# EAGLE design 3w-rgb-led-connector-mk-5.0 (EAGLE 6.5.0)
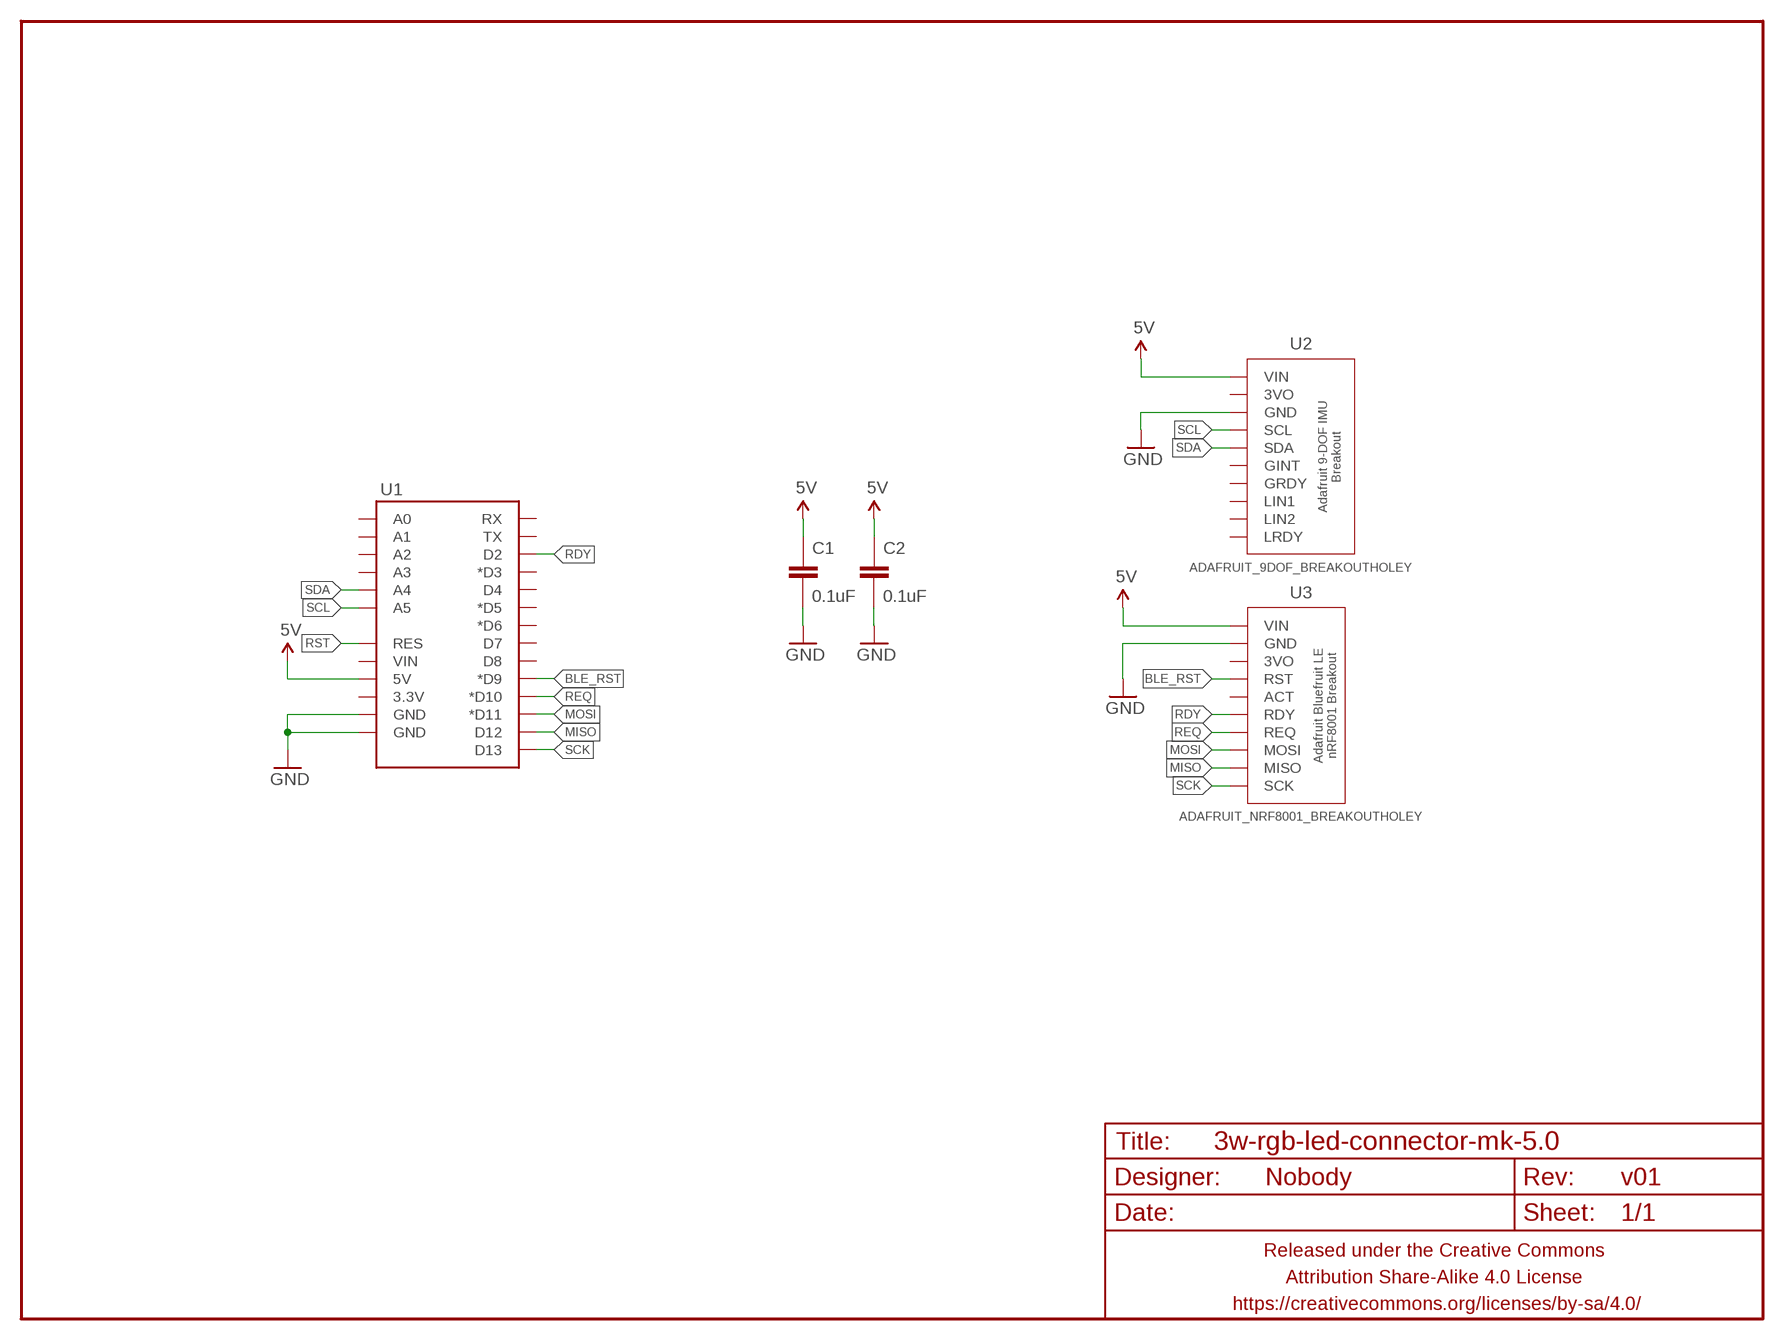
[diagram p0: schematic, sheet 1]

## Parts
C1  0.1uF  CAPACITOR-CERAMIC025-024X044  [C025-024X044]
C2  0.1uF  CAPACITOR-CERAMIC025-024X044  [C025-024X044]
FRAME1  FRAME-LETTERNO_PACKAGE  [DUMMY]
U1  ARDUINO_SHIELD_SMALLER  [ARDUINO_SHIELD_NOOUTLINE_INSIDE_SMALLER]
U2  ADAFRUIT_9DOF_BREAKOUTHOLEY  [ADAFRUIT_9DOF_BREAKOUT_HOLEY]
U3  ADAFRUIT_NRF8001_BREAKOUTHOLEY  [ADAFRUIT_NRF8001_HOLEY]

## Nets
5V: C1.1 C2.1 U1.5V U2.VIN U3.VIN
BLE_RST: U1.D9(*D9) U3.RST
GND: C1.2 C2.2 U1.GND@0(GND) U1.GND@1(GND) U2.GND U3.GND
MISO: U1.D12 U3.MISO
MOSI: U1.D11(*D11) U3.MOSI
RDY: U1.D2 U3.RDY
REQ: U1.D10(*D10) U3.REQ
RST: U1.RES
SCK: U1.D13 U3.SCK
SCL: U1.A5 U2.SCL
SDA: U1.A4 U2.SDA
Unconnected: U1.3.3V U1.A0 U1.A1 U1.A2 U1.A3 U1.D3(*D3) U1.D4 U1.D5(*D5) U1.D6(*D6) U1.D7 U1.D8 U1.RX U1.TX U1.VIN U2.3VO U2.GINT U2.GRDY U2.LIN1 U2.LIN2 U2.LRDY U3.3VO U3.ACT

## Library data of the parts
C1 C2 = A_butts:CAPACITOR-CERAMIC: CAPACITOR, European symbol
FRAME1 = A_butts:FRAME-LETTER: Schematic Frame Standard 8.5x11 US Letter frame; DESIGNER: Nobody; VERSION: v01
U1 = A_butts:ARDUINO_SHIELD_SMALLER
U2 = A_butts:ADAFRUIT_9DOF_BREAKOUT
U3 = A_butts:ADAFRUIT_NRF8001_BREAKOUT

## Board
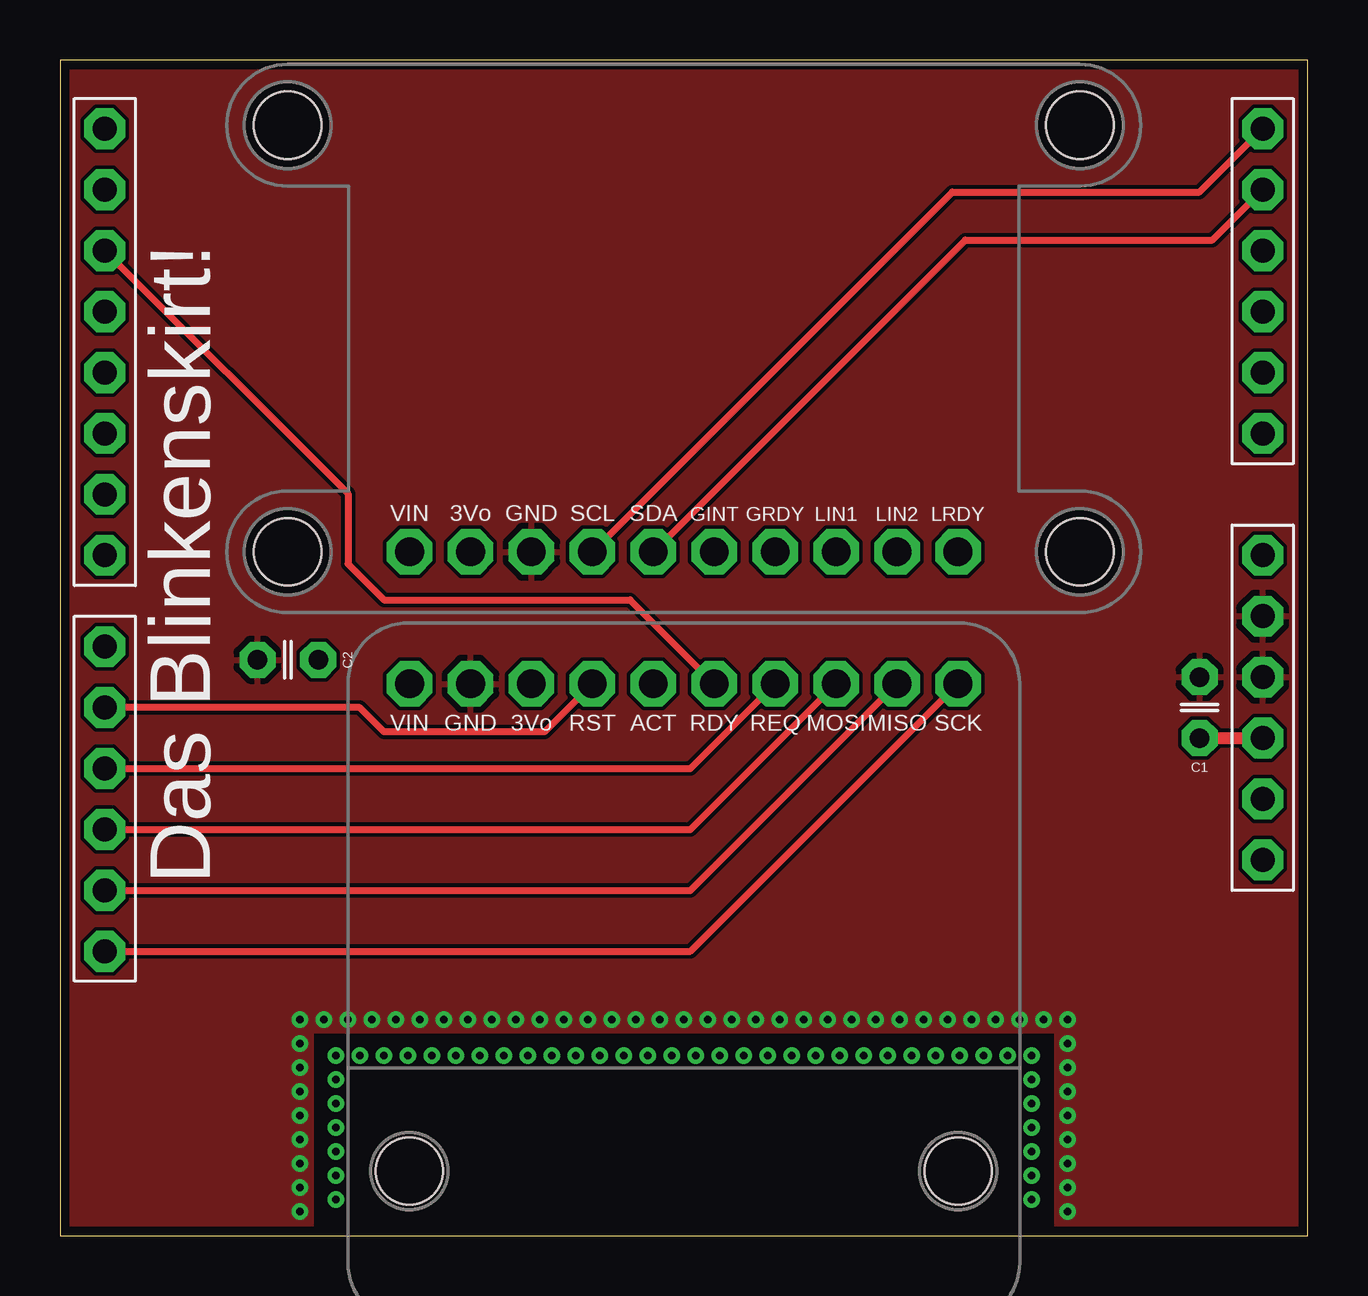
[diagram p1: board, top side]
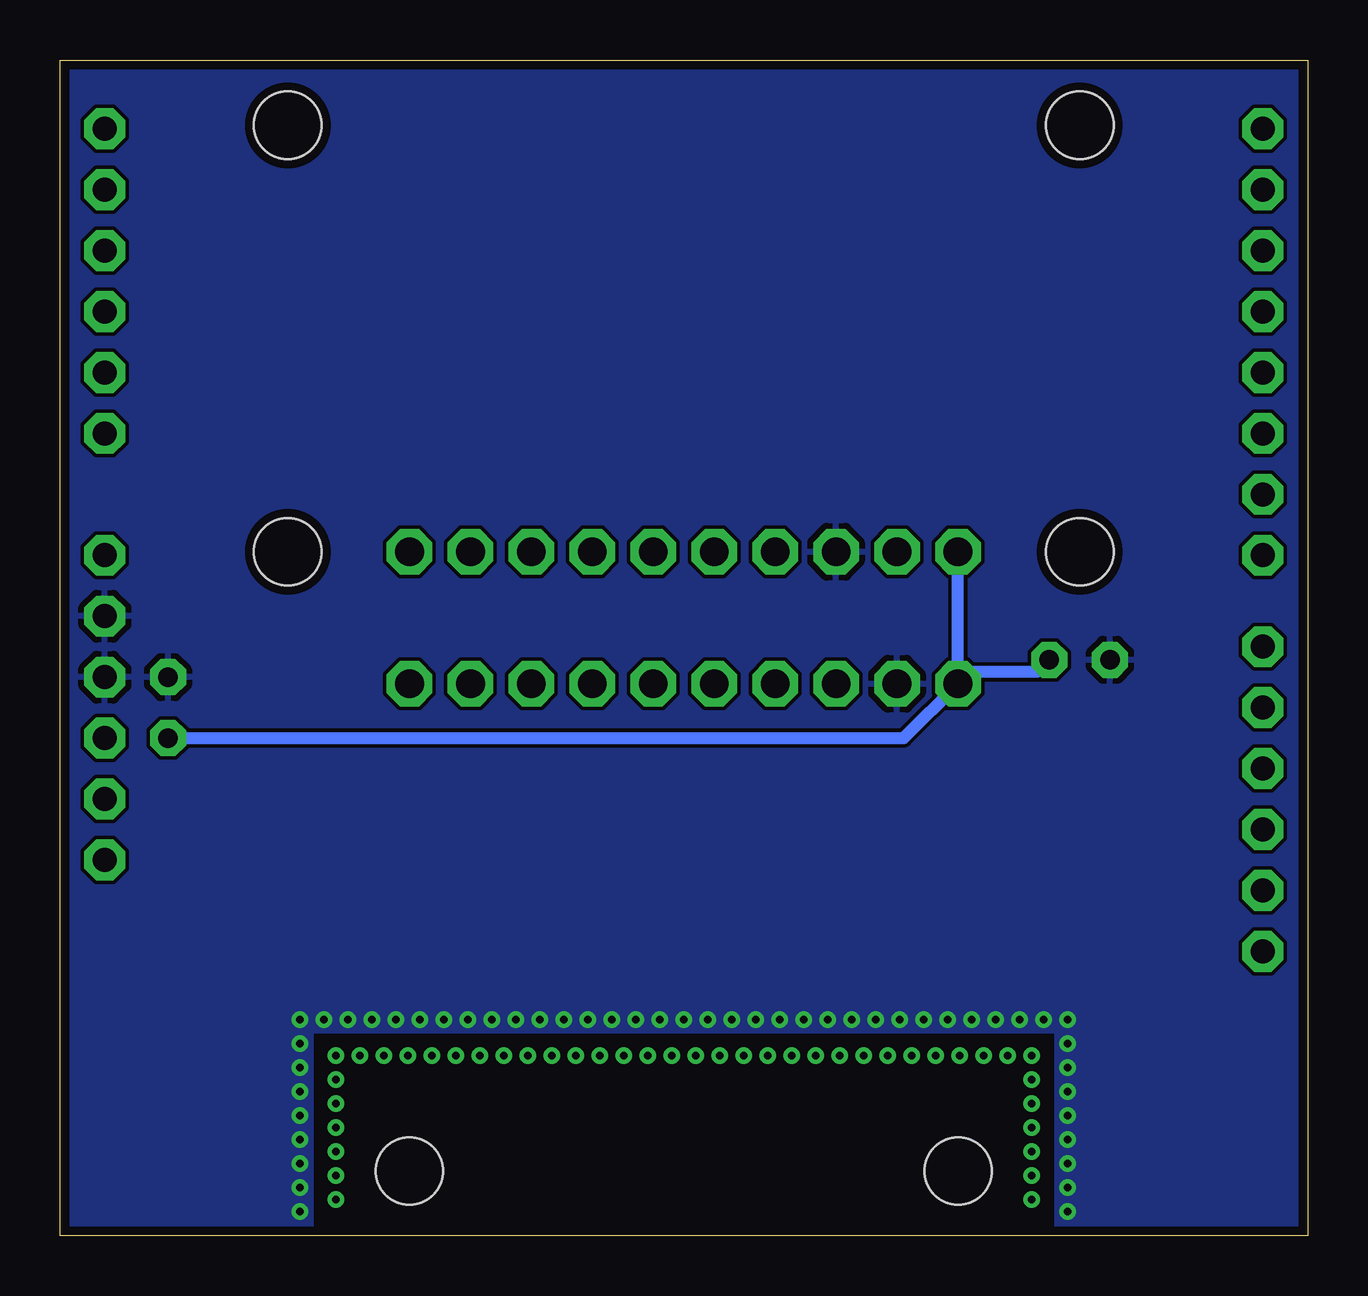
[diagram p2: board, bottom side, seen from below]

Size 52 x 49 mm. Coordinates in mm from the lower left corner, seen from the top.
Outline: 0,49 0,0 52,0 52,49 0,49
Copper layers (1*16): Top 0.0356mm / dielectric 1.5011mm / Bottom 0.0356mm
Design rules "LaenPCBOrder_2": minimum track width 6mil, minimum drill 13mil, track to track 6mil, track to pad 6mil, pad to pad 6mil, via to via 6mil, smd to smd 6mil, copper to edge 15mil, drill to drill 6mil, minimum pad ring 7mil, minimum via ring 7mil, stop-mask expansion 3mil, vias tented up to drill 20mil, thermal gap 10mil

### Footprints (pad centres in the part's own frame; a part is rotated, then mirrored left to right if it is on the bottom)
C025-024X044 = drill 0.813 pad 1.5 octagon: 1 -1.27,0; 2 1.27,0
ARDUINO_SHIELD_NOOUTLINE_INSIDE_SMALLER = drill 1 pad 1.7 octagon: 3.3V 48.26,-27.94; 5V 48.26,-25.4; A0 48.26,-12.7; A1 48.26,-10.16; A2 48.26,-7.62; A3 48.26,-5.08; A4 48.26,-2.54; A5 48.26,0; D2 0,-5.08; D3 0,-7.62; D4 0,-10.16; D5 0,-12.7; D6 0,-15.24; D7 0,-17.78; D8 0,-21.59; D9 0,-24.13; D10 0,-26.67; D11 0,-29.21; D12 0,-31.75; D13 0,-34.29; GND@0 48.26,-22.86; GND@1 48.26,-20.32; RES 48.26,-30.48; RX 0,0; TX 0,-2.54; VIN 48.26,-17.78
ADAFRUIT_9DOF_BREAKOUT_HOLEY = drill 1.2 pad 1.9 octagon: 3VO -8.89,0; GINT 1.27,0; GND -6.35,0; GRDY 3.81,0; LIN1 6.35,0; LIN2 8.89,0; LRDY 11.43,0; SCL -3.81,0; SDA -1.27,0; VIN -11.43,0 | hole 2.8: -16.51,17.78; 16.51,17.78; 16.51,0; -16.51,0
ADAFRUIT_NRF8001_HOLEY = drill 1.2 pad 1.9 octagon: 3VO 6.35,0; ACT 1.27,0; GND 8.89,0; MISO -8.89,0; MOSI -6.35,0; RDY -1.27,0; REQ -3.81,0; RST 3.81,0; SCK -11.43,0; VIN 11.43,0 | hole 2.8: -11.43,20.32; 11.43,20.32

### Placement (x,y rotation side)
C1  47.5,22 90 top
C2  9.5,24 180 top
FRAME1  0.5,0.5 0 top
U1  1.87,46.13 0 top
U2  26,28.5 0 top
U3  26,23 180 top

### Tracks (layer width: path | path; a pad name or v marks a point on that pad's centre or on a via)
5V
  Top 0.5: C1.1 U1.5V
  Bottom 0.5: C1.1 16.84,20.73 U3.VIN | U3.VIN U2.VIN | C2.1 11.27,23.5 14.07,23.5 U3.VIN
BLE_RST
  Top 0.3: U3.RST 20.19,21 13.5,21 12.49,22 U1.D9
GND  (via drill 0.33)
  other vias: 10,9 12,9 13,9 14,9 15,9 16,9 17,9 18,9 19,9 20,9 21,9 22,9 23,9 24,9 25,9 26,9 27,9 28,9 29,9 30,9 31,9 32,9 33,9 34,9 35,9 36,9 37,9 38,9 39,9 40,9 41,9 42,7 42,6 42,5 42,4 42,3 42,2 42,1 10,7 10,6 10,5 10,4 10,3 10,2 10,1 10,8 11,9 42,8 42,9
  pour Top: -0.1,49.1 52.1,49.1 52.1,-0.1 41.5,-0.1 41.5,8.5 10.5,8.5 10.5,-0.1 -0.1,-0.1
  pour Bottom: -0.1,49.1 52.1,49.1 52.1,-0.1 41.5,-0.1 41.5,8.5 10.5,8.5 10.5,-0.1 -0.1,-0.1
MISO
  Top 0.3: U1.D12 26.27,14.38 U3.MISO
MOSI
  Top 0.3: U1.D11 26.27,16.93 U3.MOSI
N$1  (via drill 0.33)
  other vias: 11.5,1.5
N$2  (via drill 0.33)
  other vias: 11.5,2.5
N$3  (via drill 0.33)
  other vias: 11.5,3.5
N$4  (via drill 0.33)
  other vias: 11.5,4.5
N$5  (via drill 0.33)
  other vias: 11.5,5.5
N$6  (via drill 0.33)
  other vias: 11.5,6.5
N$7  (via drill 0.33)
  other vias: 11.5,7.5
N$8  (via drill 0.33)
  other vias: 12.5,7.5
N$9  (via drill 0.33)
  other vias: 13.5,7.5
N$10  (via drill 0.33)
  other vias: 14.5,7.5
N$11  (via drill 0.33)
  other vias: 15.5,7.5
N$12  (via drill 0.33)
  other vias: 16.5,7.5
N$13  (via drill 0.33)
  other vias: 17.5,7.5
N$14  (via drill 0.33)
  other vias: 18.5,7.5
N$15  (via drill 0.33)
  other vias: 19.5,7.5
N$16  (via drill 0.33)
  other vias: 20.5,7.5
N$17  (via drill 0.33)
  other vias: 21.5,7.5
N$18  (via drill 0.33)
  other vias: 22.5,7.5
N$19  (via drill 0.33)
  other vias: 23.5,7.5
N$20  (via drill 0.33)
  other vias: 24.5,7.5
N$21  (via drill 0.33)
  other vias: 25.5,7.5
N$22  (via drill 0.33)
  other vias: 26.5,7.5
N$23  (via drill 0.33)
  other vias: 27.5,7.5
N$24  (via drill 0.33)
  other vias: 28.5,7.5
N$25  (via drill 0.33)
  other vias: 29.5,7.5
N$26  (via drill 0.33)
  other vias: 30.5,7.5
N$27  (via drill 0.33)
  other vias: 31.5,7.5
N$28  (via drill 0.33)
  other vias: 32.5,7.5
N$29  (via drill 0.33)
  other vias: 33.5,7.5
N$30  (via drill 0.33)
  other vias: 34.5,7.5
N$31  (via drill 0.33)
  other vias: 35.5,7.5
N$32  (via drill 0.33)
  other vias: 36.5,7.5
N$33  (via drill 0.33)
  other vias: 37.5,7.5
N$34  (via drill 0.33)
  other vias: 38.5,7.5
N$35  (via drill 0.33)
  other vias: 39.5,7.5
N$36  (via drill 0.33)
  other vias: 40.5,7.5
N$37  (via drill 0.33)
  other vias: 40.5,6.5
N$38  (via drill 0.33)
  other vias: 40.5,5.5
N$39  (via drill 0.33)
  other vias: 40.5,4.5
N$40  (via drill 0.33)
  other vias: 40.5,3.5
N$41  (via drill 0.33)
  other vias: 40.5,2.5
N$42  (via drill 0.33)
  other vias: 40.5,1.5
RDY
  Top 0.3: U1.D2 12,30.93 12,28 13.5,26.5 23.77,26.5 U3.RDY
REQ
  Top 0.3: U1.D10 26.27,19.46 U3.REQ
SCK
  Top 0.3: U1.D13 26.27,11.85 U3.SCK
SCL
  Top 0.3: U2.SCL 37.19,43.5 47.49,43.5 U1.A5
SDA
  Top 0.3: U2.SDA 37.73,41.5 48.03,41.5 U1.A4

### Text on the board
tPlace: Das Blinkenskirt!